# Altium schematic sheet SD_Card.SchDoc
size A
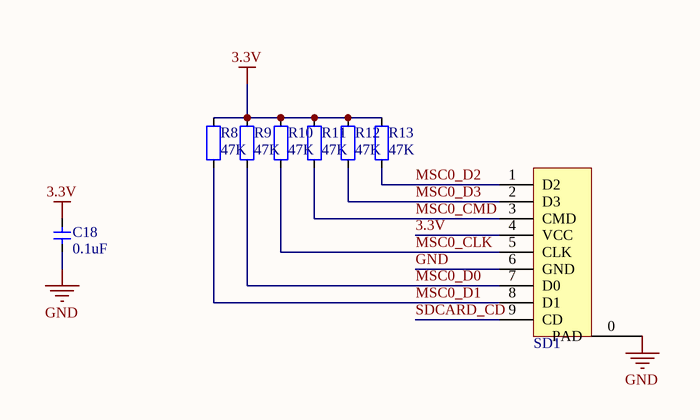
[diagram p0: SD_Card.SchDoc]

## Parts
C18  value 0.1uF  [CAP_0402]  (hidden comment: Cap_0402)
R8  value 47K  [RES_0402]  (hidden comment: Res_0402)
R9  value 47K  [RES_0402]  (hidden comment: Res_0402)
R10  value 47K  [RES_0402]  (hidden comment: Res_0402)
R11  value 47K  [RES_0402]  (hidden comment: Res_0402)
R12  value 47K  [RES_0402]  (hidden comment: Res_0402)
R13  value 47K  [RES_0402]  (hidden comment: Res_0402)
SD1  SD_Card_TF  [SD_Card_TF]  (value not drawn)

## Nets
3.3V: C18.2 R8.2 R9.2 R10.2 R11.2 R12.2 R13.2 SD1.4(VCC)
GND: C18.1 SD1.0(PAD) SD1.6(GND)
MSC0_CLK: R10.1 SD1.5(CLK)
MSC0_CMD: R11.1 SD1.3(CMD)
MSC0_D0: R9.1 SD1.7(D0)
MSC0_D1: R8.1 SD1.8(D1)
MSC0_D2: R13.1 SD1.1(D2)
MSC0_D3: R12.1 SD1.2(D3)
SDCARD_CD: SD1.9(CD)

## Library data of the parts
C18 = Cap_0402: Capacitor
R8-R13 = Res_0402: Resistor
SD1 = SD_Card_TF: SD